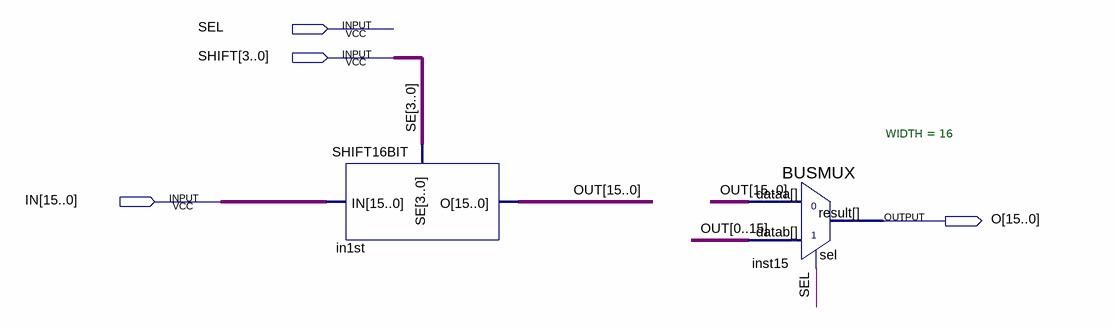
[diagram p0: schematic sheet]
// Quartus schematic SHIFT_16BIT.bdf as structural Verilog: 2 symbols, 4 pins
module SHIFT_16BIT (
  input  SEL,
  input  [3:0] SHIFT,
  input  [15:0] IN,
  output [15:0] O
);

  wire [15:0] OUT;

  SHIFT16BIT in1st (.SE(SHIFT), .IN(IN), .O(OUT));
  BUSMUX #(.WIDTH(16)) inst15 (
    .datab({OUT[0], OUT[1], OUT[2], OUT[3], OUT[4], OUT[5], OUT[6], OUT[7], OUT[8], OUT[9], OUT[10], OUT[11], OUT[12], OUT[13], OUT[14], OUT[15]}),
    .sel(SEL), .dataa(OUT), .result(O));

  // Other names for the same wires on the sheet: SE[3:0] = SHIFT
endmodule
